# EAGLE schematic Skripsi_layout v5 (EAGLE 9.7.0)
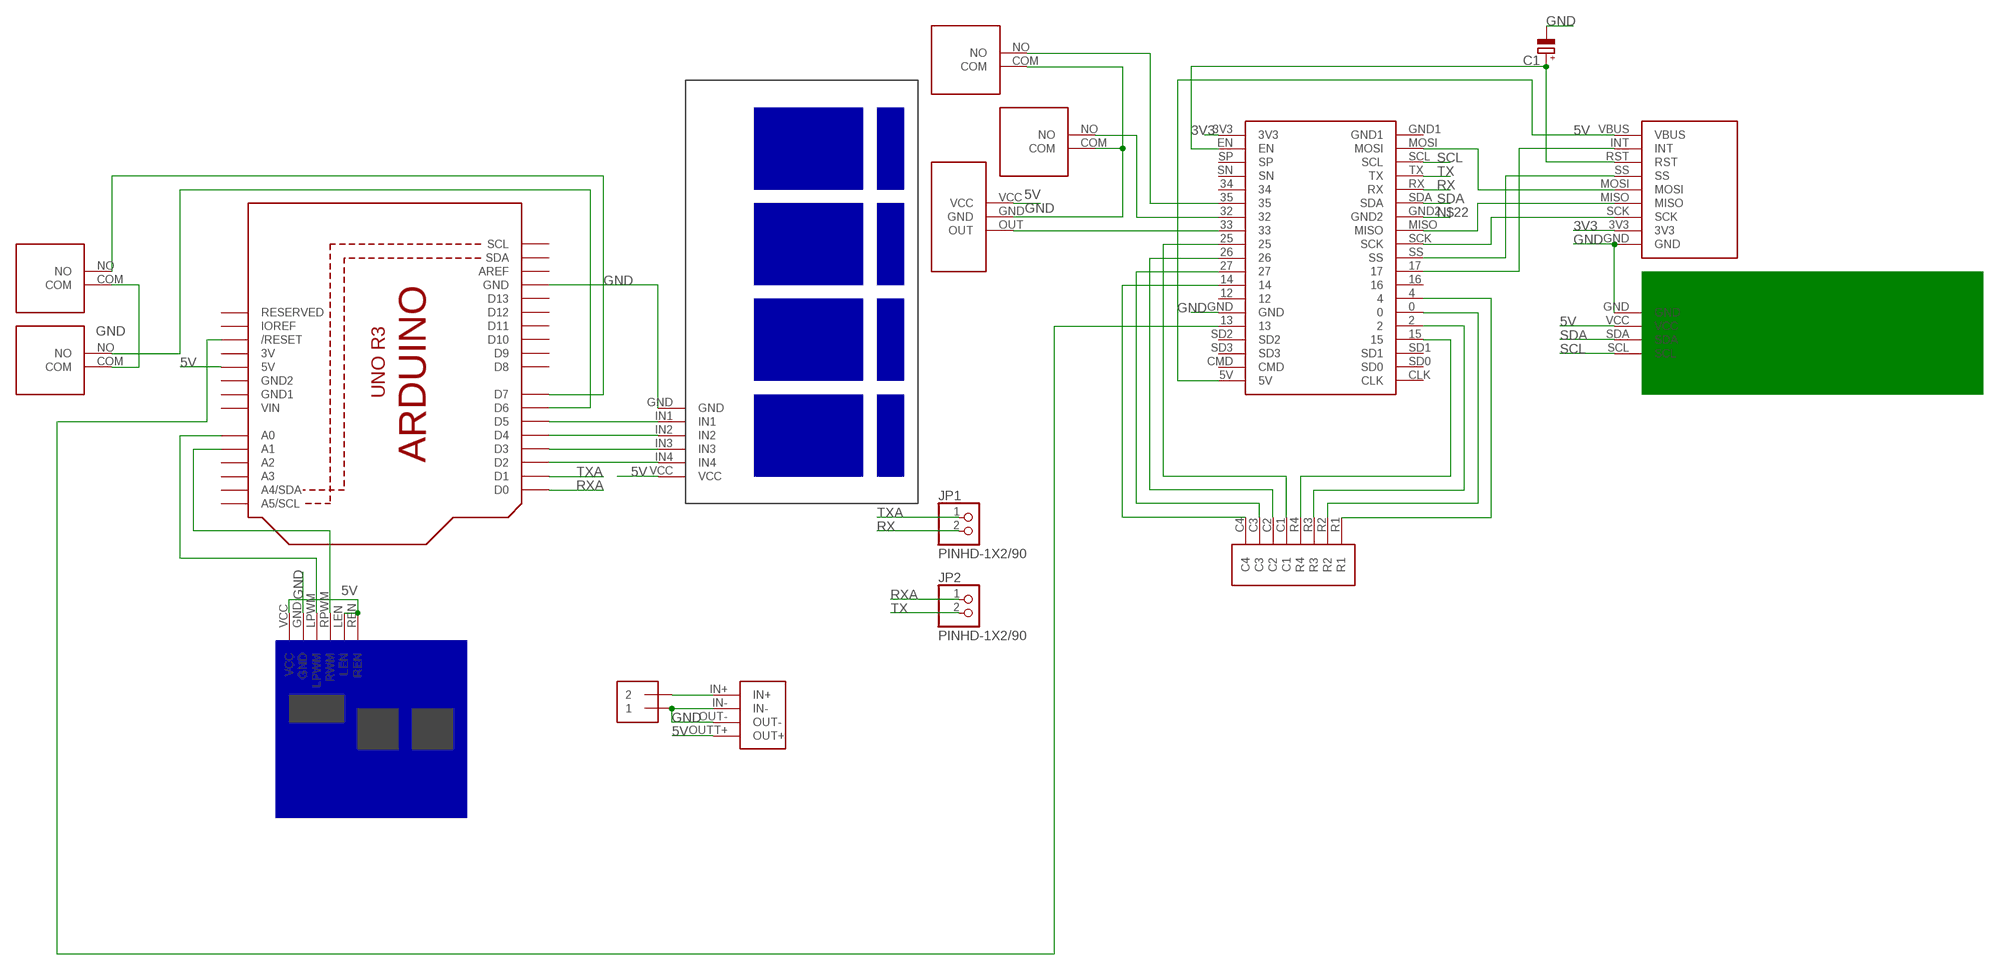
[diagram p0: schematic, sheet 1]

## Parts
C1  C-POL_RADIAL-25MM-DIA  [CAPPRD550W110D1250H2500B]
J1  1X2-3.5MM  [1X2-3.5MM]
JP1  PINHD-1X2/90  [1X02/90]
JP2  PINHD-1X2/90  [1X02/90]
U$1  ARDUINO_UNO  [ARDUINO_UNO]
U$2  ESP32_NEW  [ESP32_NEW]
U$3  USB_HOST  [USB_HOST]
U$4  LCD_I2C  [LCD_I2C]
U$5  KEYPAD_4X4  [KEYPAD_4X4]
U$6  IR_SENSOR  [IR_SENSOR]
U$7  SWITCHLIMITER  [SWICHLIMITER]
U$8  SWITCHLIMITER  [SWICHLIMITER]
U$9  RELAY_4CHANNEL  [RELAY_4CHANNEL]
U$10  MOTOR_DRIVER_BTS7960  [MOTOR_DRIVER_BTS7960]
U$11  SWITCHLIMITER  [SWICHLIMITER]
U$12  SWITCHLIMITER  [SWICHLIMITER]
U$13  XL4005E1  [XL4005E1]

## Nets
3V3: U$2.3V3 U$3.3V3
5V: U$1.5V U$2.5V U$3.VBUS U$4.VCC U$6.VCC U$9.VCC U$10.LEN U$10.REN U$10.VCC U$13.OUTT+(OUT+)
GND: C1.2(-) J1.1 U$1.GND U$2.GND U$3.GND U$4.GND U$6.GND U$7.COM U$8.COM U$9.GND U$10.GND U$11.COM U$12.COM U$13.IN- U$13.OUT-
N$1: U$2.4 U$5.R1
N$2: U$2.17 U$3.INT
N$3: C1.1(+) U$2.EN U$3.RST
N$4: U$2.SS U$3.SS
N$5: U$2.SCK U$3.SCK
N$6: U$2.MISO U$3.MISO
N$7: U$2.MOSI U$3.MOSI
N$8: U$2.0 U$5.R2
N$9: U$2.2 U$5.R3
N$10: U$2.15 U$5.R4
N$11: U$2.25 U$5.C1
N$12: U$1.D2 U$9.IN4
N$13: U$1.D3 U$9.IN3
N$14: U$2.26 U$5.C2
N$15: U$2.27 U$5.C3
N$16: U$2.14 U$5.C4
N$17: U$1.D4 U$9.IN2
N$18: U$2.32 U$8.NO
N$19: U$2.33 U$6.OUT
N$20: U$2.35 U$7.NO
N$21: U$1.D5 U$9.IN1
N$22: U$2.GND2
N$23: U$1.D6 U$12.NO
N$24: U$1.A0 U$10.LPWM
N$25: U$1.A1 U$10.RPWM(RWM)
N$26: U$1.D7 U$11.NO
N$27: J1.2 U$13.IN+
N$28: U$1.RESET(/RESET) U$2.13
RX: JP1.2 U$2.RX
RXA: JP2.1 U$1.D0
SCL: U$2.SCL U$4.SCL
SDA: U$2.SDA U$4.SDA
TX: JP2.2 U$2.TX
TXA: JP1.1 U$1.D1
Unconnected: U$1.A2 U$1.A3 U$1.A4(A4/SDA) U$1.A5(A5/SCL) U$1.AREF U$1.D8 U$1.D9 U$1.D10 U$1.D11 U$1.D12 U$1.D13 U$1.IOREF U$1.RESERVED U$1.SCL U$1.SDA U$2.12 U$2.16 U$2.34 U$2.CLK U$2.CMD U$2.GND1 U$2.SD0 U$2.SD1 U$2.SD2 U$2.SD3 U$2.SN U$2.SP

## Power pins joined to a net without a drawn wire
3V: U$1.3V
GND1: U$1.GND1
GND2: U$1.GND2
VIN: U$1.VIN

## Library data of the parts
C1 = Capacitor:C-POL: Capacitor Polarised - Generic; CATEGORY: Capacitor
J1 = adafruit:1X2: 3.5mm Terminal block http://www.ladyada.net/library/pcb/eaglelibrary.html
JP1 JP2 = Connector:PINHD-1X2: PIN HEADER; CATEGORY: CONNECTOR; SUB-CATEGORY: PIN-HEADER
U$1 = FusionLocal:ARDUINO_UNO
U$2 = FusionLocal:ESP32_NEW
U$3 = FusionLocal:USB_HOST
U$4 = LocalLib:LCD_I2C
U$5 = FusionLocal:KEYPAD_4X4
U$6 = LocalLib:IR_SENSOR
U$7 U$8 U$11 U$12 = LocalLib:SWITCHLIMITER
U$9 = LocalLib:RELAY_4CHANNEL
U$10 = LocalLib:MOTOR_DRIVER_BTS7960
U$13 = FusionLocal:XL4005E1